# EAGLE design SparkFun_Pi_Wedge_B_Plus (EAGLE 6.5.0)
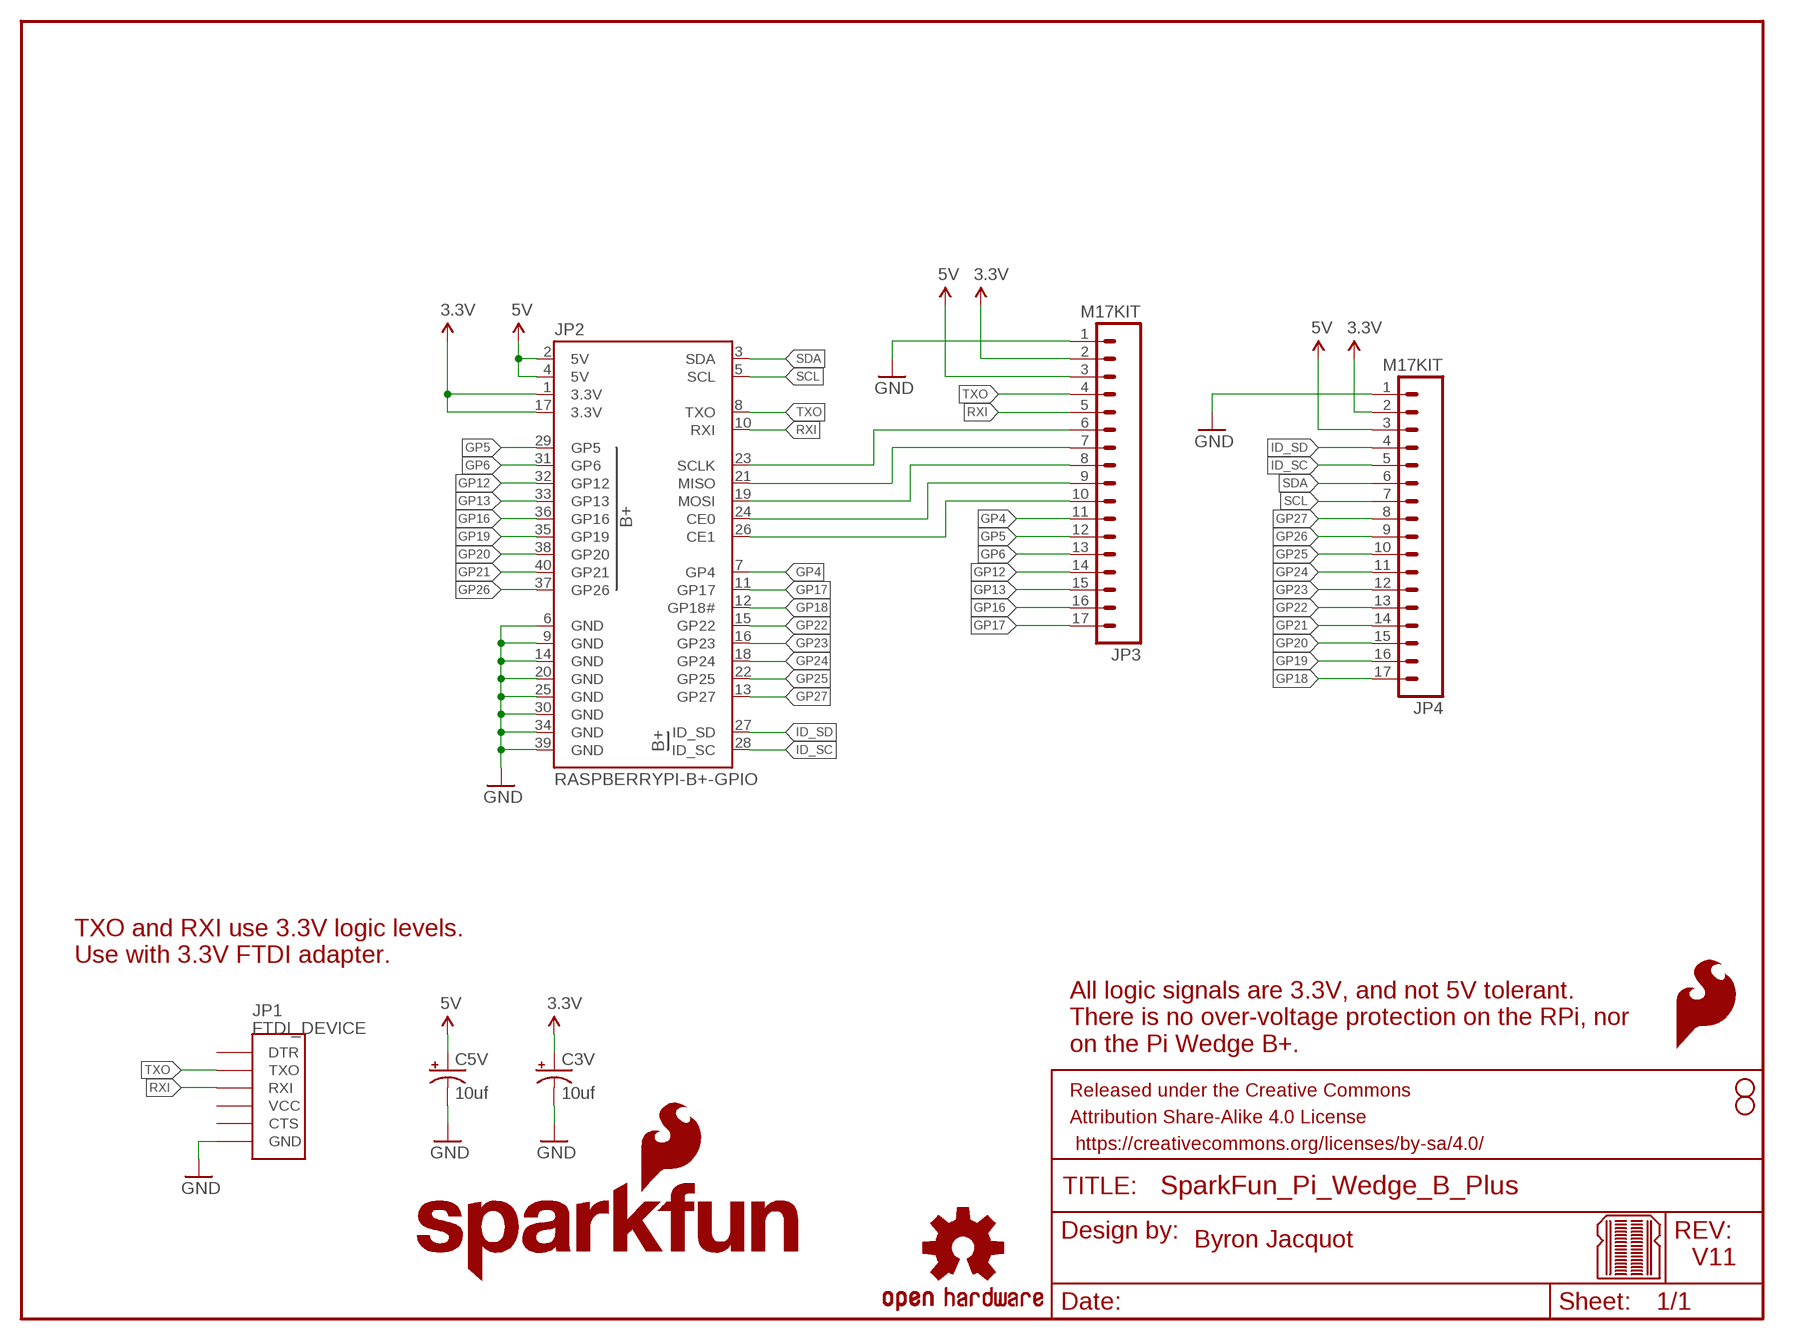
[diagram p0: schematic, sheet 1]

## Parts
C3V  10uf  10UF-25V-20%(PTH)KIT  [CPOL-RADIAL-10UF-25V-KIT]
C5V  10uf  10UF-25V-20%(PTH)KIT  [CPOL-RADIAL-10UF-25V-KIT]
FRAME2  FRAME-LETTER  [CREATIVE_COMMONS]
JP1  FTDI_DEVICE  [FTDI_DEVICE_SIDE]
JP2  RASPBERRYPI-B+-GPIO  [2X20-SHROUDED]
JP3  M17KIT  [1X17_NO_SILK_KIT]
JP4  M17KIT  [1X17_NO_SILK_KIT]
LOGO1  SFE_LOGO_NAME_FLAME.2_INCH  [SFE_LOGO_NAME_FLAME_.2]
LOGO2  SFE_LOGO_NAME_FLAME.2_INCH  [SFE_LOGO_NAME_FLAME_.2]
LOGO3  SFE_LOGO_FLAME.1_INCH  [SFE_LOGO_FLAME_.1]
LOGO4  SFE_LOGO_FLAME.1_INCH  [SFE_LOGO_FLAME_.1]
LOGO5  OSHW-LOGOS  [OSHW-LOGO-S]
STANDOFF1  STAND-OFF  [STAND-OFF]
STANDOFF2  STAND-OFF  [STAND-OFF]
U$2  BREADBOARD_PATTERN  [BREADBOARD_SPACING]

## Nets
3.3V: C3V.1(+) JP2.1(3.3V) JP2.17(3.3V) JP3.2 JP4.2
5V: C5V.1(+) JP2.2(5V) JP2.4(5V) JP3.3 JP4.3
CE0: JP2.24(CE0) JP3.9
CE1: JP2.26(CE1) JP3.10
GND: C3V.2(-) C5V.2(-) JP1.P$6(GND) JP2.6(GND) JP2.9(GND) JP2.14(GND) JP2.20(GND) JP2.25(GND) JP2.30(GND) JP2.34(GND) JP2.39(GND) JP3.1 JP4.1
GP4: JP2.7(GP4) JP3.11
GP5: JP2.29(GP5) JP3.12
GP6: JP2.31(GP6) JP3.13
GP12: JP2.32(GP12) JP3.14
GP13: JP2.33(GP13) JP3.15
GP16: JP2.36(GP16) JP3.16
GP17: JP2.11(GP17) JP3.17
GP18: JP2.12(GP18#) JP4.17
GP19: JP2.35(GP19) JP4.16
GP20: JP2.38(GP20) JP4.15
GP21: JP2.40(GP21) JP4.14
GP22: JP2.15(GP22) JP4.13
GP23: JP2.16(GP23) JP4.12
GP24: JP2.18(GP24) JP4.11
GP25: JP2.22(GP25) JP4.10
GP26: JP2.37(GP26) JP4.9
GP27: JP2.13(GP27) JP4.8
ID_SC: JP2.28(ID_SC) JP4.5
ID_SD: JP2.27(ID_SD) JP4.4
MISO: JP2.21(MISO) JP3.7
MOSI: JP2.19(MOSI) JP3.8
RXI: JP1.P$3(RXI) JP2.10(RXI) JP3.5
SCL: JP2.5(SCL) JP4.7
SCLK: JP2.23(SCLK) JP3.6
SDA: JP2.3(SDA) JP4.6
TXO: JP1.P$2(TXO) JP2.8(TXO) JP3.4
Unconnected: JP1.P$1(DTR) JP1.P$4(VCC) JP1.P$5(CTS)

## Notes on the sheet
- TXO and RXI use 3.3V logic levels.
  Use with 3.3V FTDI adapter.
- All logic signals are 3.3V, and not 5V tolerant.
  There is no over-voltage protection on the RPi, nor
  on the Pi Wedge B+.
- Byron Jacquot
- V11

## Library data of the parts
C3V C5V = SparkFun-Capacitors:10UF-25V-20%(PTH): CAP-08440; PROD_ID: CAP-08440
FRAME2 = SparkFun-Aesthetics:FRAME-LETTER: Schematic Frame Standard 8.5x11 US Letter frame
JP1 = SparkFun-Connectors:FTDI_DEVICE: Connector which mates to FTDI basic or FTDI cable.
JP2 = SparkFun-Boards:RASPBERRYPI-B+-GPIO: Raspberry Pi B+ GPIO Header 2x20 pin connector
JP3 JP4 = SparkFun-Connectors:M17: 1x17 .1" header
LOGO1 LOGO2 = SparkFun-Aesthetics:SFE_LOGO_NAME_FLAME: SFE Logo, name and flame This is the SparkFun full logo. The logo on the schematic will always be the same size; the package variant is the height of the flame part of the logo. Default layer for the logo on the board is tSilk.
LOGO3 LOGO4 = SparkFun-Aesthetics:SFE_LOGO_FLAME: SFE Logo, flame only This is the SparkFun flame logo. The logo on the schematic will always be the same size; the package variant is the height of the flame. Default layer for the logo on the board is tSilk.
LOGO5 = SparkFun-Aesthetics:OSHW-LOGO: Open Source Hardware Logo This logo indicates the piece of hardware it is found on incorporates a OSHW license and/or adheres to the definition of open source hardware found here: http://freedomdefined.org/OSHW
STANDOFF1 STANDOFF2 = SparkFun-Electromechanical:STAND-OFF: #4 Stand Off This is the mechanical footprint for a #4 phillips button head screw. Use the keepout ring to avoid running the screw head into surrounding components. SKU : PRT-00447
U$2 = SparkFun-Aesthetics:BREADBOARD_PATTERN: Reference markings that correspond to solderless breadboard row spacing.

## Board
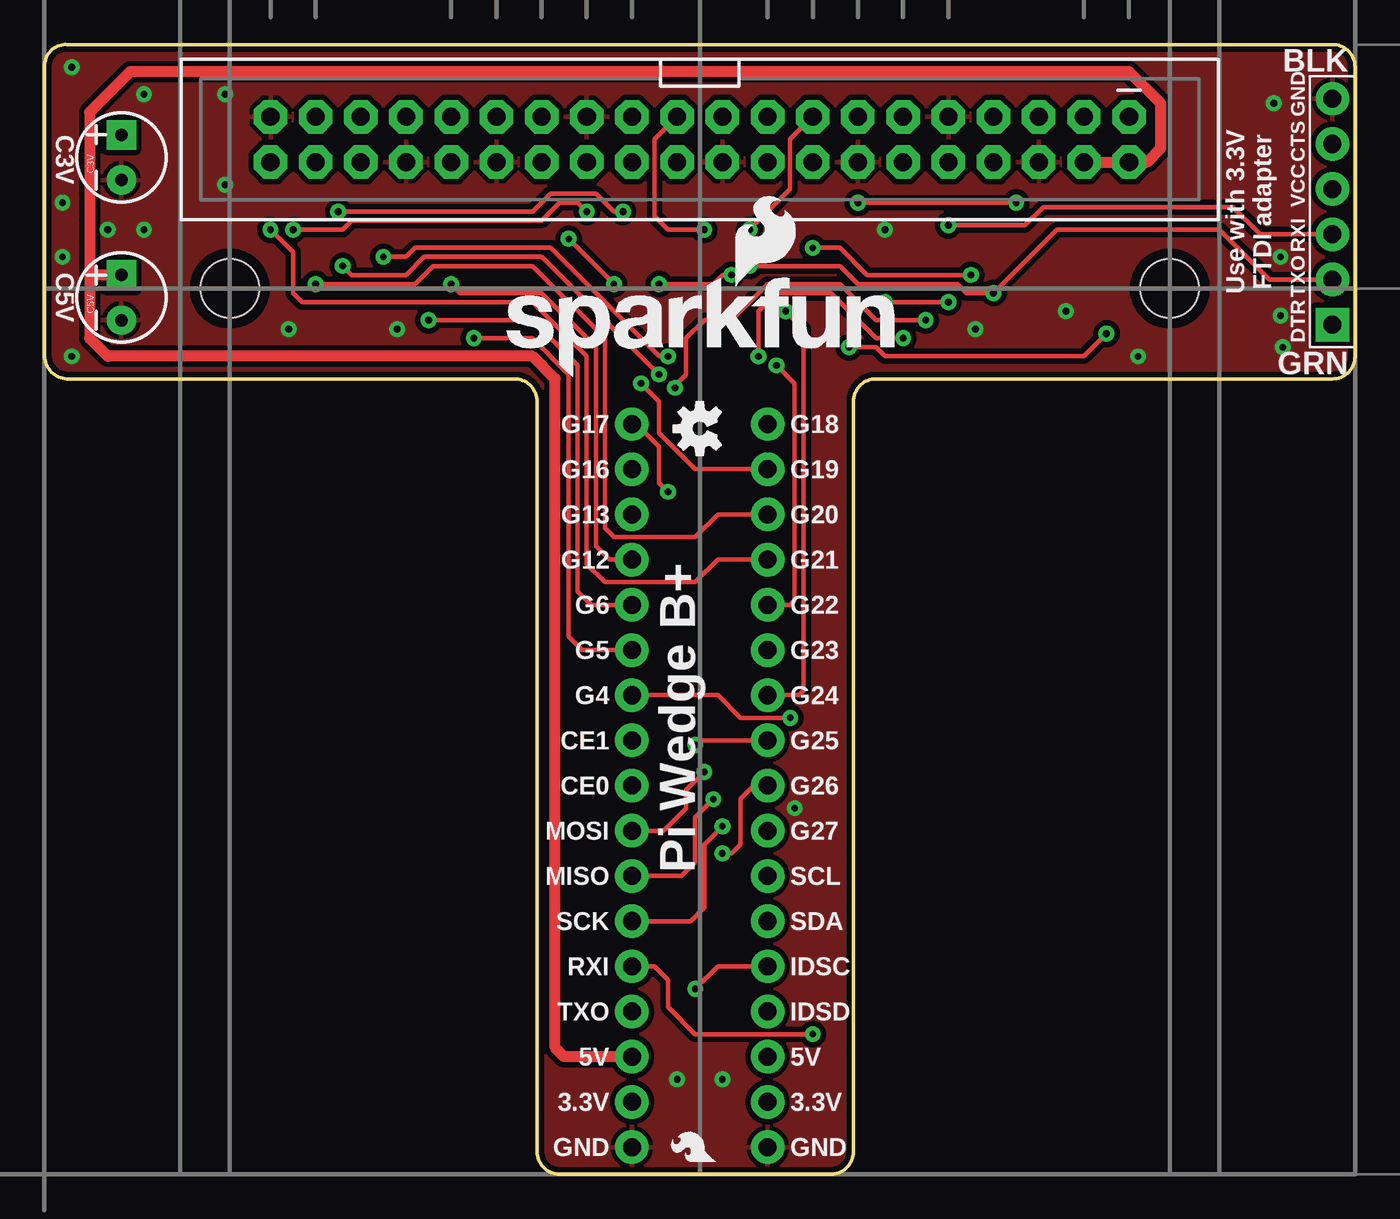
[diagram p1: board, top side]
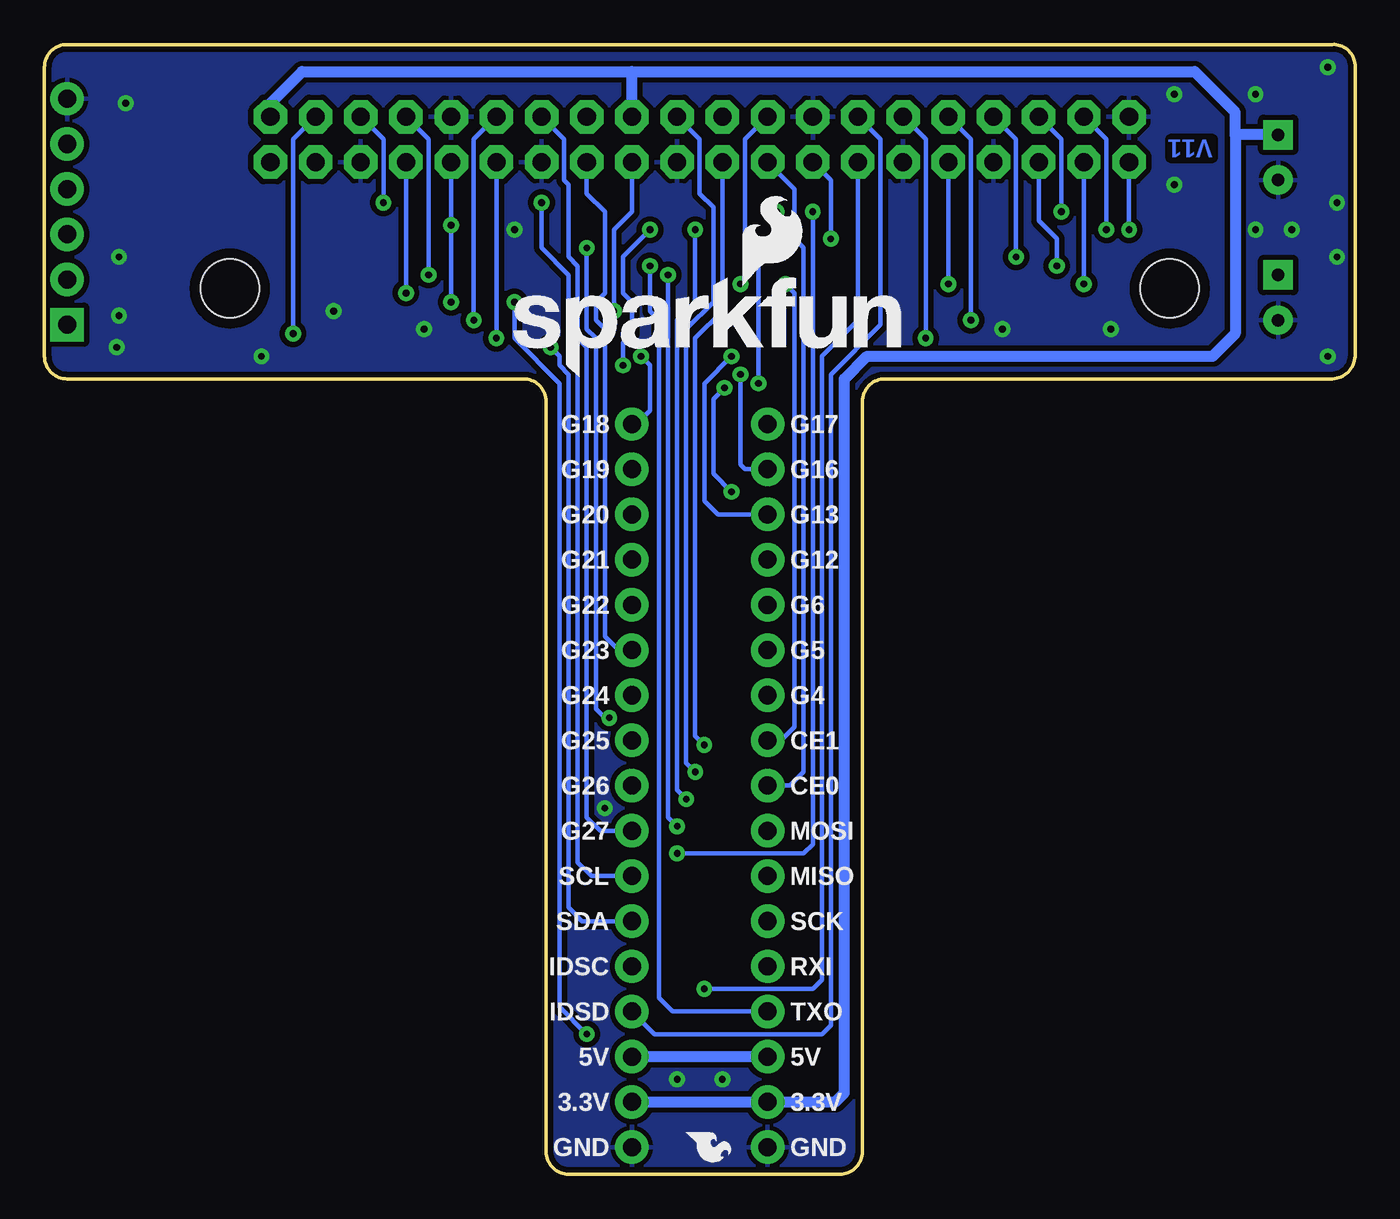
[diagram p2: board, bottom side, seen from below]

Size 73.66 x 63.5 mm. Coordinates in mm from the lower left corner, seen from the top.
Outline: 73.66,62.23 73.66,45.97 arc-90 72.39,44.7 46.74,44.7 arc90 45.47,43.43 45.47,1.27 arc-90 44.2,0 28.96,0 arc-90 27.69,1.27 27.69,43.43 arc90 26.42,44.7 1.27,44.7 arc-90 0,46.1 0,62.36 arc-90 1.27,63.5 72.39,63.5 arc-90 73.66,62.23
Copper layers (1*16): Top 0.035mm / dielectric 1.5mm / Bottom 0.035mm
Design rules "SparkFun-2-layer *": minimum track width 7mil, minimum drill 15mil, track to track 8mil, track to pad 8mil, pad to pad 8mil, via to via 8mil, smd to smd 8mil, copper to edge 8mil, drill to drill 8mil, minimum pad ring 12mil, minimum via ring 10mil, stop-mask expansion 4mil, vias tented up to drill 20mil, thermal gap 10mil

### Footprints (pad centres in the part's own frame; a part is rotated, then mirrored left to right if it is on the bottom)
CPOL-RADIAL-10UF-25V-KIT = drill 0.7 pad 1.651 square: 1 1.27,0 | drill 0.7 pad 1.651: 2 -1.27,0
FTDI_DEVICE_SIDE = drill 1.016 pad 1.88 square: P$1 -6.35,0 | drill 1.016 pad 1.88: P$2 -3.81,0; P$3 -1.27,0; P$4 1.27,0; P$5 3.81,0; P$6 6.35,0
2X20-SHROUDED = drill 1.016 pad 1.88 octagon: 1 -1.27,24.13; 2 1.27,24.13; 3 -1.27,21.59; 4 1.27,21.59; 5 -1.27,19.05; 6 1.27,19.05; 7 -1.27,16.51; 8 1.27,16.51; 9 -1.27,13.97; 10 1.27,13.97; 11 -1.27,11.43; 12 1.27,11.43; 13 -1.27,8.89; 14 1.27,8.89; 15 -1.27,6.35; 16 1.27,6.35; 17 -1.27,3.81; 18 1.27,3.81; 19 -1.27,1.27; 20 1.27,1.27; 21 -1.27,-1.27; 22 1.27,-1.27; 23 -1.27,-3.81; 24 1.27,-3.81; 25 -1.27,-6.35; 26 1.27,-6.35; 27 -1.27,-8.89; 28 1.27,-8.89; 29 -1.27,-11.43; 30 1.27,-11.43; 31 -1.27,-13.97; 32 1.27,-13.97; 33 -1.27,-16.51; 34 1.27,-16.51; 35 -1.27,-19.05; 36 1.27,-19.05; 37 -1.27,-21.59; 38 1.27,-21.59; 39 -1.27,-24.13; 40 1.27,-24.13
1X17_NO_SILK_KIT = drill 1.016 pad 1.88: 1 0,0; 2 2.54,0; 3 5.08,0; 4 7.62,0; 5 10.16,0; 6 12.7,0; 7 15.24,0; 8 17.78,0; 9 20.32,0; 10 22.86,0; 11 25.4,0; 12 27.94,0; 13 30.48,0; 14 33.02,0; 15 35.56,0; 16 38.1,0; 17 40.64,0
STAND-OFF = hole 3.302: 0,0

### Placement (x,y rotation side)
C3V  4.32,57.15 90 top
C5V  4.32,49.28 90 top
FRAME2  20.32,-8.38 0 top  (outside the outline)
JP1  72.39,54.1 90 top
JP2  36.83,58.17 270 top
JP3  33.02,1.52 90 bottom
JP4  40.64,1.52 90 bottom
LOGO1  25.27,44.7 0 top
LOGO2  48.01,44.7 0 bottom
LOGO3  38.1,0.38 90 top
LOGO4  37.97,2.67 270 bottom
LOGO5  36.83,41.91 90 top
STANDOFF1  10.41,49.78 0 top
STANDOFF2  63.25,49.78 0 top
U$2  36.83,66.29 0 top

### Tracks (layer width: path | path; a pad name or v marks a point on that pad's centre or on a via)
3.3V
  Bottom 0.61: JP4.2 JP3.2 29.21,4.06 28.7,4.57 28.7,44.7 27.43,45.97 8,45.97 6.73,47.24 6.73,58.42 | 40.64,61.98 59.18,61.98 60.96,60.2 JP2.1 | 40.64,61.98 9.02,61.98 6.73,59.69 6.73,58.42 | JP2.17 40.64,61.98 | C3V.1 6.73,58.42
5V
  Top 0.61: JP3.3 29.21,6.6 28.7,7.11 28.7,44.7 27.43,45.97 3.56,45.97 2.54,46.99 2.54,50.55 | JP2.4 JP2.2 61.98,56.9 62.74,57.66 62.74,60.2 60.96,61.98 4.83,61.98 2.54,59.69 2.54,50.55 | C5V.1 2.54,50.55
  Bottom 0.61: JP3.3 JP4.3
CE0
  Bottom 0.254: JP3.9 31.75,21.84 30.99,22.61 30.99,52.07 31.5,52.58 31.5,55.37 JP2.24
CE1  (via drill 0.38)
  Top 0.254: v32,50.04 v29.46,52.58
  Bottom 0.254: JP3.10 32.26,24.38 31.5,25.15 31.5,49.53 v32,50.04 | v29.46,52.58 29.46,55.88 JP2.26
GND  (via drill 0.38)
  other vias: 35.56,5.33 38.1,5.33 69.09,60.2 69.47,48.26 69.6,46.48 61.47,45.97 1.52,62.23 1.02,54.61 1.02,51.56 1.52,45.97 5.59,53.09 5.59,60.71 42.16,20.57 47.24,53.09 69.47,51.56 3.56,53.09 10.16,60.71 10.16,55.63 19.81,47.5 13.72,47.5 57.4,48.51 52.32,47.5
  pour Bottom (isolate 0.305): 1.27,44.7 26.42,44.7 arc-90 27.69,43.43 27.69,1.27 arc90 28.96,0 44.2,0 arc90 45.47,1.27 45.47,43.43 arc-90 46.74,44.7 72.39,44.7 arc90 73.66,45.97 73.66,62.23 arc90 72.39,63.5 1.27,63.5 arc90 0,62.36 0,46.1 arc90
  pour Top (isolate 0.305): 45.47,43.43 45.47,1.27 arc-90 44.2,0 28.96,0 arc-90 27.69,1.27 27.69,43.43 arc90 26.42,44.7 1.27,44.7 arc-90 0,46.1 0,62.36 arc-90 1.27,63.5 72.39,63.5 arc-90 73.66,62.23 73.66,45.97 arc-90 72.39,44.7 46.74,44.7 arc90
GP4  (via drill 0.38)
  Top 0.254: JP3.11 37.85,26.92 39.12,25.65 v41.91,25.65 | v43.18,52.07 44.7,52.07 46.23,50.55 v52.07,50.55
  Bottom 0.254: v41.91,25.65 42.16,25.65 42.67,26.16 42.67,46.99 43.18,47.5 v43.18,52.07 | v52.07,50.55 52.07,58.17 JP2.7
GP5  (via drill 0.38)
  Top 0.254: JP3.12 30.23,29.46 29.46,30.23 29.46,44.96 27.43,46.99 v24.13,46.99
  Bottom 0.254: JP2.29 24.13,58.17 v24.13,46.99
GP6  (via drill 0.38)
  Top 0.254: JP3.13 30.73,32 29.97,32.77 29.97,45.47 27.43,48.01 v21.59,48.01
  Bottom 0.254: JP2.31 21.59,58.17 v21.59,48.01
GP12  (via drill 0.38)
  Top 0.254: JP3.14 31.75,34.54 30.99,35.31 30.99,46.48 27.94,49.53 23.37,49.53 v22.86,50.04
  Bottom 0.254: v22.86,50.04 JP2.32
GP13  (via drill 0.38)
  Top 0.254: v35.05,45.97 34.54,45.97 28.45,52.07 20.83,52.07 20.32,51.56 v19.05,51.56
  Bottom 0.254: JP3.15 35.81,37.08 36.58,37.85 36.58,44.45 v35.05,45.97 | v19.05,51.56 19.05,58.17 JP2.33
GP16  (via drill 0.38)
  Top 0.254: v34.54,44.96 27.94,51.56 21.34,51.56 20.32,50.55 17.27,50.55 v16.76,51.05
  Bottom 0.254: JP3.16 34.29,39.62 34.54,39.88 v34.54,44.96 | v16.76,51.05 16.76,52.58 17.78,53.59 JP2.36
GP17  (via drill 0.38)
  Top 0.254: JP3.17 33.27,42.16 34.54,40.89 34.54,38.86 v35.05,38.35 | v35.43,44.2 35.43,44.32 36.07,44.96 36.07,46.99 37.08,48.01 38.61,48.01 40.64,50.04 44.7,50.04 46.74,48.01 v49.53,48.01
  Bottom 0.254: v35.05,38.35 36.07,39.37 36.07,43.56 v35.43,44.2 | JP2.11 49.53,58.17 v49.53,48.01
GP18  (via drill 0.38)
  Top 0.254: v40.13,45.97 40.13,48.51 41.15,49.53 44.2,49.53 46.74,46.99 v48.26,46.99
  Bottom 0.254: JP4.17 40.39,42.16 39.62,42.93 39.62,45.47 v40.13,45.97 | v48.26,46.99 JP2.12
GP19  (via drill 0.38)
  Top 0.254: JP4.16 36.58,39.62 34.54,41.66 34.54,43.43 v33.53,44.45 | v32.51,54.1 32,54.1 30.99,55.12 28.45,55.12 27.43,54.1 v16.51,54.1
  Bottom 0.254: v33.53,44.45 33.53,51.56 32.51,52.58 v32.51,54.1 | v16.51,54.1 16.51,58.17 JP2.35
GP20  (via drill 0.38)
  Top 0.254: JP4.15 37.85,37.08 36.58,35.81 32,35.81 31.5,36.32 31.5,46.99 27.43,51.05 21.84,51.05 20.83,50.04 v15.24,50.04
  Bottom 0.254: v15.24,50.04 JP2.38
GP21  (via drill 0.38)
  Top 0.254: JP4.14 37.85,34.54 36.58,33.27 31.5,33.27 30.48,34.29 30.48,45.97 27.43,49.02 14.48,49.02 13.97,49.53 13.97,51.82 v12.7,53.09
  Bottom 0.254: v12.7,53.09 JP2.40
GP22  (via drill 0.38)
  Top 0.254: JP4.13 41.91,32 42.16,32.26 42.16,44.45 v41.15,45.47 | v39.62,53.09 41.91,55.37 41.91,58.17 JP2.15
  Bottom 0.254: v41.15,45.47 41.15,46.74 40.64,47.24 40.64,49.02 41.15,49.53 41.15,51.56 v39.62,53.09
GP23
  Bottom 0.254: JP4.12 41.4,29.46 42.16,30.23 42.16,47.5 42.67,48.01 42.67,49.02 42.16,49.53 42.16,54.1 43.18,55.12 JP2.16
GP24  (via drill 0.38)
  Top 0.254: JP4.11 42.42,26.92 42.67,27.18 42.67,47.5 v41.66,48.51
  Bottom 0.254: v41.66,48.51 41.66,53.09 40.64,54.1 JP2.18
GP25  (via drill 0.38)
  Top 0.254: JP4.10 36.83,24.38 v36.58,24.13
  Bottom 0.254: v36.58,24.13 37.08,24.64 37.08,46.99 35.56,48.51 JP2.22
GP26  (via drill 0.38)
  Top 0.254: JP4.9 39.88,21.84 39.12,21.08 39.12,18.54 38.61,18.03 v38.1,18.03 | v30.48,54.1 29.97,54.61 28.96,54.61 27.94,53.59 17.27,53.59 16.76,53.09 v13.97,53.09
  Bottom 0.254: v38.1,18.03 30.99,18.03 30.48,18.54 v30.48,54.1 | JP2.37 13.97,58.17 v13.97,53.09
GP27
  Bottom 0.254: JP4.8 42.42,19.3 43.18,20.07 43.18,46.48 43.69,46.99 43.69,51.05 44.2,51.56 44.2,55.63 44.45,55.88 44.45,58.17 JP2.13
ID_SC  (via drill 0.38)
  Top 0.254: JP4.5 37.85,11.68 v36.58,10.41
  Bottom 0.254: v36.58,10.41 30.48,10.41 29.97,10.92 29.97,45.97 27.94,48.01 JP2.28
ID_SD
  Bottom 0.254: JP4.4 39.37,7.87 29.97,7.87 29.46,8.38 29.46,44.96 26.67,47.75 26.67,58.17 JP2.27
MISO  (via drill 0.38)
  Top 0.254: JP3.7 35.81,16.76 36.58,17.53 36.58,20.07 v37.59,21.08 | v37.08,53.09 35.05,53.09 34.29,53.85 34.29,58.17 JP2.21
  Bottom 0.254: v37.59,21.08 38.1,21.59 38.1,48.01 37.08,49.02 v37.08,53.09
MOSI  (via drill 0.38)
  Top 0.254: JP3.8 34.8,19.3 36.07,20.57 36.07,21.59 v37.08,22.61
  Bottom 0.254: v37.08,22.61 37.59,23.11 37.59,47.5 36.07,49.02 36.07,54.36 36.83,55.12 36.83,58.17 JP2.19
RXI  (via drill 0.38)
  Top 0.254: JP3.5 34.29,11.68 35.05,10.92 35.05,9.4 36.58,7.87 v43.18,7.87 | v47.24,49.02 v50.8,49.02 | JP1.P$3 68.33,52.83 66.8,54.36 56.13,54.36 55.12,53.34 v50.8,53.34
  Bottom 0.254: v43.18,7.87 44.7,9.4 44.7,44.45 47.24,46.99 v47.24,49.02 | v50.8,49.02 v50.8,53.34 JP2.10
SCL  (via drill 0.38)
  Top 0.254: v45.72,54.61 v54.61,54.61
  Bottom 0.254: JP4.7 42.93,16.76 43.69,17.53 43.69,45.97 44.2,46.48 44.2,50.55 45.72,52.07 v45.72,54.61 | v54.61,54.61 54.61,58.17 JP2.5
SCLK  (via drill 0.38)
  Top 0.254: JP3.6 36.32,14.22 37.08,14.99 37.08,18.54 v38.1,19.56 | v34.54,50.04 37.59,50.04 38.1,50.55 v38.61,50.55
  Bottom 0.254: v38.1,19.56 38.61,20.07 v38.61,50.55 | JP2.23 34.29,58.17 34.29,50.29 v34.54,50.04
SDA  (via drill 0.38)
  Top 0.254: v45.21,46.48 46.74,46.48 47.24,45.97 58.42,45.97 v59.69,47.24
  Bottom 0.254: JP2.3 59.69,58.17 v59.69,47.24 | JP4.6 43.43,14.22 44.2,14.99 44.2,44.96 44.7,45.47 44.7,45.97 v45.21,46.48
TXO  (via drill 0.38)
  Top 0.254: JP1.P$2 68.83,50.29 66.04,53.09 56.9,53.09 v53.34,49.53 51.82,49.53 51.31,50.04 45.72,50.04 44.7,51.05 v39.62,51.05
  Bottom 0.254: JP3.4 38.35,9.14 39.12,9.91 39.12,48.01 39.62,48.51 v39.62,51.05 | v53.34,49.53 JP2.8

### Text on the board
Bottom: V11
tPlace: C3V | Use with 3.3V / FTDI adapter | C5V | G17 | G18 | G16 | G19 | G13 | G20 | G12 | G21 | G6 | G22 | G5 | G23 | G4 | G24 | Pi Wedge B+ | CE1 | G25 | CE0 | G26 | MOSI | G27 | MISO | SCL | SCK | SDA | RXI | IDSC | TXO | IDSD | 5V | 5V | 3.3V | 3.3V | GND | GND
bPlace: G17 | G18 | G16 | G19 | G13 | G20 | G12 | G21 | G6 | G22 | G5 | G23 | G4 | G24 | CE1 | G25 | CE0 | G26 | MOSI | G27 | MISO | SCL | SCK | SDA | RXI | IDSC | TXO | IDSD | 5V | 5V | 3.3V | 3.3V | GND | GND
tDocu: Byron Jacquot